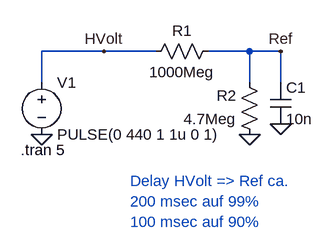
[diagram p0: schematic ref_delay.asc]
ref_delay.asc, the LTspice schematic file:
Version 4
SHEET 1 880 680
WIRE 48 96 -48 96
WIRE 128 96 48 96
WIRE 272 96 208 96
WIRE 320 96 272 96
WIRE -48 144 -48 96
WIRE 272 144 272 96
WIRE 320 144 320 96
FLAG -48 224 0
FLAG 272 224 0
FLAG 320 208 0
FLAG 48 96 HVolt
FLAG 320 96 Ref
SYMBOL voltage -48 128 R0
WINDOW 123 0 0 Left 0
WINDOW 39 0 0 Left 0
SYMATTR InstName V1
SYMATTR Value PULSE(0 440 1 1u 0 1)
SYMBOL res 224 80 R90
WINDOW 0 0 56 VBottom 2
WINDOW 3 32 56 VTop 2
SYMATTR InstName R1
SYMATTR Value 1000Meg
SYMBOL res 288 240 R180
WINDOW 0 36 76 Left 2
WINDOW 3 36 40 Left 2
SYMATTR InstName R2
SYMATTR Value 4.7Meg
SYMBOL cap 304 144 R0
SYMATTR InstName C1
SYMATTR Value 10n
TEXT -80 248 Left 2 !.tran 5
TEXT 88 296 Left 2 ;Delay HVolt => Ref ca. \n200 msec auf 99%\n100 msec auf 90%

The netlist it stands for:
* ref_delay.asc
V1 HVolt 0 PULSE(0 440 1 1u 0 1)
R1 Ref HVolt 1000Meg
R2 0 Ref 4.7Meg
C1 Ref 0 10n
.tran 5
* Delay HVolt => Ref ca.
* 200 msec auf 99%
* 100 msec auf 90%
.backanno
.end